# EAGLE schematic Quad_Board (EAGLE 6.5.0)
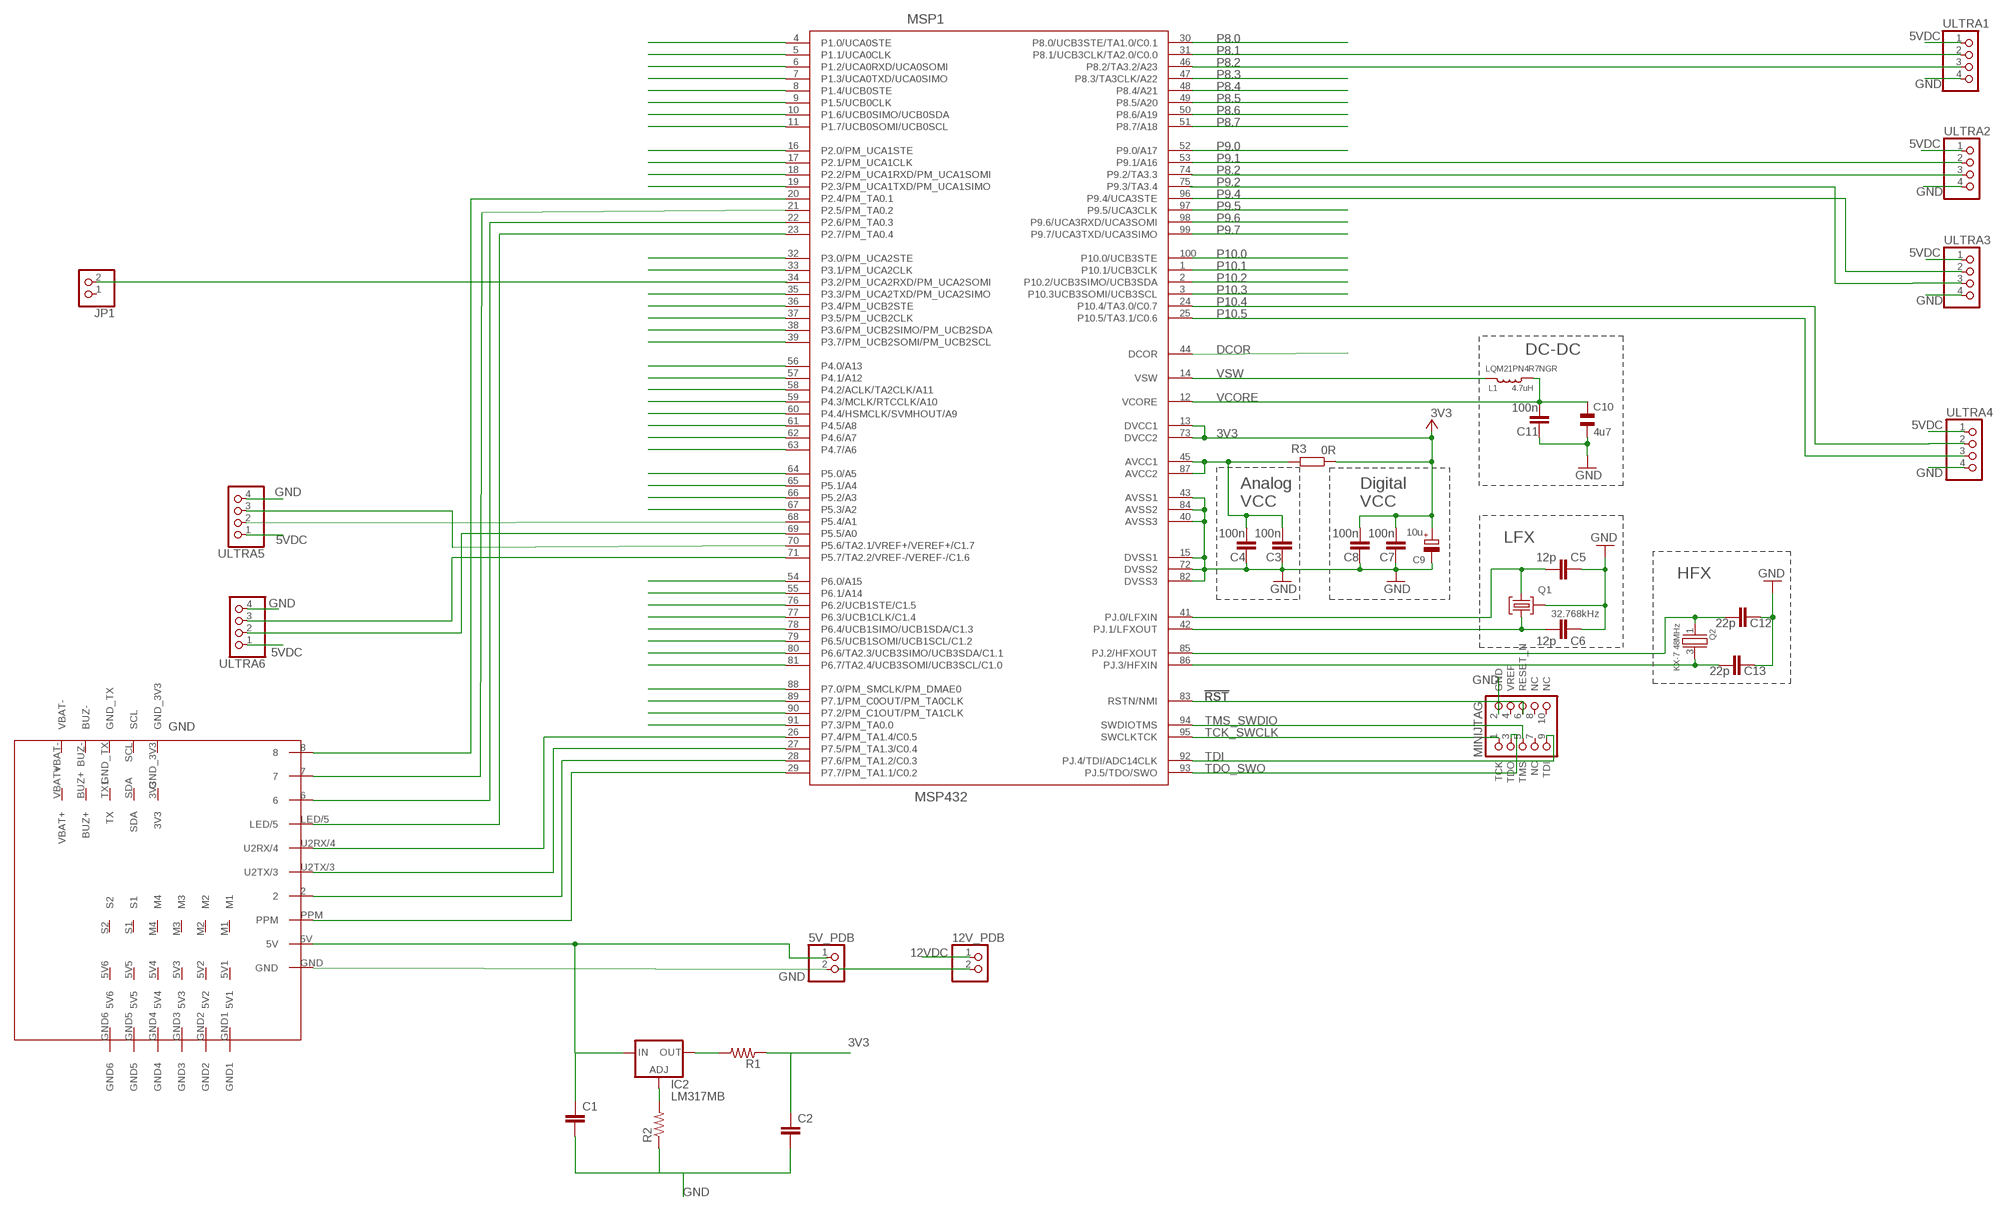
[diagram p0: schematic, sheet 1]

## Parts
5V_PDB  PINHD-1X2  [1X02]
12V_PDB  PINHD-1X2  [1X02]
C1  C2.5/2  [C2.5-2]
C2  C2.5/2  [C2.5-2]
C3  100n  C-EUCM0402  [0402]
C4  100n  C-EUCM0402  [0402]
C5  12p  C-EUCM0402  [0402]
C6  12p  C-EUCM0402  [0402]
C7  100n  C-EUCM0402  [0402]
C8  100n  C-EUCM0402  [0402]
C9  10u  CPOL-EUA/3216-18R  [A/3216-18R]
C10  4u7  CSMD0805  [CSMD0805]
C11  100n  C-EUCM0402  [0402]
C12  22p  C-EUCM0402  [0402]
C13  22p  C-EUCM0402  [0402]
IC2  LM317MB  [TO220L1]
JP1  PINHD-1X2  [1X02]
L1  4.7uH  LQM2MP_G0  [0806]
MINIJTAG  JTAG-AVR-IDC  [PAK100/2500-10]
MSP1  MSP432  [PZ100]
Q1  32.768kHz  MS3V-T1R  [MS3V-T1R]
Q2  KX-7 48MHz  KX-7  [KX-7]
R1  R-US_0204/5  [0204/5]
R2  R-US_0204/5  [0204/5]
R3  0R  R-EU_RM0402  [0402]
U$2  NAZE32_FC  [NAZE32_BOARD_FOOTPRINT]
ULTRA1  PINHD-1X4  [1X04]
ULTRA2  PINHD-1X4  [1X04]
ULTRA3  PINHD-1X4  [1X04]
ULTRA4  PINHD-1X4  [1X04]
ULTRA5  PINHD-1X4  [1X04]
ULTRA6  PINHD-1X4  [1X04]

## Nets
3V3: C2.1 C7.1 C8.1 C9.+ MSP1.13(DVCC1) MSP1.73(DVCC2) R1.1 R3.1 ; supply symbol labelled +3V3
5VDC: C1.1 IC2.3(IN) U$2.5V ULTRA1.1 ULTRA2.1 ULTRA3.1 ULTRA4.1 ULTRA5.1 ULTRA6.1
12VDC: 12V_PDB.1
!RST: MINIJTAG.6(RESET_N) MSP1.83(RSTN/NMI)
DCOR: MSP1.44(DCOR)
GND: 5V_PDB.2 C1.2 C2.2 C3.2 C4.2 C5.2 C6.2 C7.2 C8.2 C9.- C10.2 C11.2 C12.2 C13.2 MINIJTAG.2(GND) MSP1.15(DVSS1) MSP1.40(AVSS3) MSP1.43(AVSS1) MSP1.72(DVSS2) MSP1.82(DVSS3) MSP1.84(AVSS2) Q1.P3(GND) R2.1 U$2.GND ULTRA1.4 ULTRA2.4 ULTRA3.4 ULTRA4.4 ULTRA5.4 ULTRA6.4
N$2: C3.1 C4.1 MSP1.45(AVCC1) MSP1.87(AVCC2) R3.2
N$3: ULTRA1.2
N$4: 12V_PDB.2
N$5: ULTRA3.3
N$6: MSP1.75(P9.3/TA3.4)
N$7: C6.1 MSP1.42(PJ.1/LFXOUT) Q1.P1
N$8: C5.1 MSP1.41(PJ.0/LFXIN) Q1.P2
N$10: JP1.2
N$13: ULTRA3.2
N$17: ULTRA4.2
N$28: IC2.1(ADJ) R2.2
N$29: IC2.2(OUT) R1.2
P1.0_LED1: MSP1.4(P1.0/UCA0STE)
P1.1_BUTTON1: MSP1.5(P1.1/UCA0CLK)
P1.2_BCLUART_RXD: MSP1.6(P1.2/UCA0RXD/UCA0SOMI)
P1.3_BCLUART_TXD: MSP1.7(P1.3/UCA0TXD/UCA0SIMO)
P1.4_BUTTON2: MSP1.8(P1.4/UCB0STE)
P1.5_SPICLK_J1.7: MSP1.9(P1.5/UCB0CLK)
P1.6_SPIMOSI_J2.15: MSP1.10(P1.6/UCB0SIMO/UCB0SDA)
P1.7_SPIMISO_J2.14: MSP1.11(P1.7/UCB0SOMI/UCB0SCL)
P2.0_RGBLED_RED: MSP1.16(P2.0/PM_UCA1STE)
P2.1_RGBLED_GREEN: MSP1.17(P2.1/PM_UCA1CLK)
P2.2_RGBLED_BLUE: MSP1.18(P2.2/PM_UCA1RXD/PM_UCA1SOMI)
P2.3_IO_J4.34: MSP1.19(P2.3/PM_UCA1TXD/PM_UCA1SIMO)
P2.4_PWM_J4.38: MSP1.20(P2.4/PM_TA0.1) U$2.8
P2.5_PWM_J2.19: MSP1.21(P2.5/PM_TA0.2) U$2.7
P2.6_PWM_J4.39: MSP1.22(P2.6/PM_TA0.3) U$2.6
P2.7_PWM_J4.40: MSP1.23(P2.7/PM_TA0.4) U$2.LED/5
P3.0_IO_J2.18: MSP1.32(P3.0/PM_UCA2STE)
P3.1_BCLUART_RTS: MSP1.33(P3.1/PM_UCA2CLK)
P3.3_UTXD_J1.4: MSP1.35(P3.3/PM_UCA2TXD/PM_UCA2SIMO)
P3.4_BCLUART_CTS: MSP1.36(P3.4/PM_UCB2STE)
P3.5_IO_J4.32: MSP1.37(P3.5/PM_UCB2CLK)
P3.6_IO_J2.11: MSP1.38(P3.6/PM_UCB2SIMO/PM_UCB2SDA)
P3.7_IO_J4.31: MSP1.39(P3.7/PM_UCB2SOMI/PM_UCB2SCL)
P4.0_A13_J3.24: MSP1.56(P4.0/A13)
P4.1_IO_J1.5: MSP1.57(P4.1/A12)
P4.2_A11_J3.25: MSP1.58(P4.2/ACLK/TA2CLK/A11)
P4.3_A10_J1.6: MSP1.59(P4.3/MCLK/RTCCLK/A10)
P4.4_A9_J3.26: MSP1.60(P4.4/HSMCLK/SVMHOUT/A9)
P4.5_A8_J3.27: MSP1.61(P4.5/A8)
P4.6_IO_J1.8: MSP1.62(P4.6/A7)
P4.7_A6_J3.28: MSP1.63(P4.7/A6)
P5.0_IO_J2.13: MSP1.64(P5.0/A5)
P5.1_IO_J4.33: MSP1.65(P5.1/A4)
P5.2/XT2IN1: C13.1 MSP1.86(PJ.3/HFXIN) Q2.3
P5.2_IO_J2.12: MSP1.66(P5.2/A3)
P5.3: MSP1.67(P5.3/A2)
P5.3/XT2OUT1: C12.1 MSP1.85(PJ.2/HFXOUT) Q2.1
P5.4_IO_J3.29: MSP1.68(P5.4/A1) ULTRA5.2
P5.5_IO_J3.30: MSP1.69(P5.5/A0) ULTRA6.2
P5.6_PWM_J4.37: MSP1.70(P5.6/TA2.1/VREF+/VEREF+/C1.7) ULTRA5.3
P5.7_IO_J2.17: MSP1.71(P5.7/TA2.2/VREF-/VEREF-/C1.6) ULTRA6.3
P6.0_A15_J1.2: MSP1.54(P6.0/A15)
P6.1_A14_J3.23: MSP1.55(P6.1/A14)
P6.2: MSP1.76(P6.2/UCB1STE/C1.5)
P6.3: MSP1.77(P6.3/UCB1CLK/C1.4)
P6.4_I2CSDA_J1.10: MSP1.78(P6.4/UCB1SIMO/UCB1SDA/C1.3)
P6.5_I2CSCL_J1.9: MSP1.79(P6.5/UCB1SOMI/UCB1SCL/C1.2)
P6.6_CAPTURE_J4.36: MSP1.80(P6.6/TA2.3/UCB3SIMO/UCB3SDA/C1.1)
P6.7_CAPTURE_J4.35: MSP1.81(P6.7/TA2.4/UCB3SOMI/UCB3SCL/C1.0)
P7.0: MSP1.88(P7.0/PM_SMCLK/PM_DMAE0)
P7.1: MSP1.89(P7.1/PM_C0OUT/PM_TA0CLK)
P7.2: MSP1.90(P7.2/PM_C1OUT/PM_TA1CLK)
P7.3: MSP1.91(P7.3/PM_TA0.0)
P7.4: MSP1.26(P7.4/PM_TA1.4/C0.5) U$2.U2RX/4
P7.5: MSP1.27(P7.5/PM_TA1.3/C0.4) U$2.U2TX/3
P7.6: MSP1.28(P7.6/PM_TA1.2/C0.3) U$2.2
P7.7: MSP1.29(P7.7/PM_TA1.1/C0.2) U$2.PPM
P8.0: MSP1.30(P8.0/UCB3STE/TA1.0/C0.1)
P8.1: MSP1.31(P8.1/UCB3CLK/TA2.0/C0.0)
P8.2: MSP1.46(P8.2/TA3.2/A23) ULTRA1.3
P8.3: MSP1.47(P8.3/TA3CLK/A22)
P8.4: MSP1.48(P8.4/A21)
P8.5: MSP1.49(P8.5/A20)
P8.6: MSP1.50(P8.6/A19)
P8.7: MSP1.51(P8.7/A18)
P9.0: MSP1.52(P9.0/A17)
P9.1: MSP1.53(P9.1/A16) ULTRA2.2
P9.2: MSP1.74(P9.2/TA3.3) ULTRA2.3
P9.4: MSP1.96(P9.4/UCA3STE)
P9.5: MSP1.97(P9.5/UCA3CLK)
P9.6: MSP1.98(P9.6/UCA3RXD/UCA3SOMI)
P9.7: MSP1.99(P9.7/UCA3TXD/UCA3SIMO)
P10.0: MSP1.100(P10.0/UCB3STE)
P10.1: MSP1.1(P10.1/UCB3CLK)
P10.2: MSP1.2(P10.2/UCB3SIMO/UCB3SDA)
P10.3: MSP1.3(P10.3UCB3SOMI/UCB3SCL)
P10.4: MSP1.24(P10.4/TA3.0/C0.7)
P10.5: MSP1.25(P10.5/TA3.1/C0.6) ULTRA4.3
TCK_SWCLK: MINIJTAG.1(TCK) MSP1.95(SWCLKTCK)
TDI: MINIJTAG.9(TDI) MSP1.92(PJ.4/TDI/ADC14CLK)
TDO_SWO: MINIJTAG.3(TDO) MSP1.93(PJ.5/TDO/SWO)
TMS_SWDIO: MINIJTAG.5(TMS) MSP1.94(SWDIOTMS)
VCORE: C10.1 C11.1 L1.1 MSP1.12(VCORE)
VSW: L1.2 MSP1.14(VSW)
Unconnected: 5V_PDB.1 JP1.1 MINIJTAG.4(VREF) MINIJTAG.7(NC) MINIJTAG.8(NC) MINIJTAG.10(NC) U$2.3V3 U$2.5V1 U$2.5V2 U$2.5V3 U$2.5V4 U$2.5V5 U$2.5V6 U$2.BUZ+ U$2.BUZ- U$2.GND1 U$2.GND2 U$2.GND3 U$2.GND4 U$2.GND5 U$2.GND6 U$2.GND_3V3 U$2.GND_TX U$2.M1 U$2.M2 U$2.M3 U$2.M4 U$2.S1 U$2.S2 U$2.SCL U$2.SDA U$2.TX1(TX) U$2.VBAT+ U$2.VBAT-

## Notes on the sheet
- DC-DC
- LQM21PN4R7NGR
- Analog | Digital
- VCC | VCC
- LFX
- HFX

## Power pins joined to a net without a drawn wire
P3.2/PM_UCA2RXD/PM_UCA2SOMI: MSP1.34(P3.2/PM_UCA2RXD/PM_UCA2SOMI)

## Library data of the parts
5V_PDB 12V_PDB JP1 = pinhead:PINHD-1X2: PIN HEADER
C1 C2 = capacitor-wima:C: CAPACITOR naming: grid - package width
C3-C8 C11-C13 = rcl:C-EU: CAPACITOR, European symbol
C9 = rcl:CPOL-EU: POLARIZED CAPACITOR, European symbol
C10 = cap:CSMD0805
IC2 = v-reg:LM317?*: 500 mA Adjustable Output Positive Voltage Regulator Source: http://www.onsemi.co.jp .. LM317M-D.PDF
L1 = Murata:LQM2MP_G0
MINIJTAG = kblom:JTAG-AVR: Atmel AVR JTAG source (AVR32) <http://www.atmel.com/dyn/resources/prod_documents/doc32002.pdf?source=cms> con
MSP1 = MSP-EXP432:MSP432
Q1 = microcrystal:MS3V-T1R
Q2 = Geyer:KX-7
R1 R2 = rcl:R-US_: RESISTOR, American symbol
R3 = rcl:R-EU_: RESISTOR, European symbol
U$2 = Naze32_FCBoard:NAZE32_FC
ULTRA1-ULTRA6 = pinhead:PINHD-1X4: PIN HEADER

## Net classes
0 default: width 0.254 mm